# EAGLE design octanis_eps_v04 (EAGLE 7.2.0)
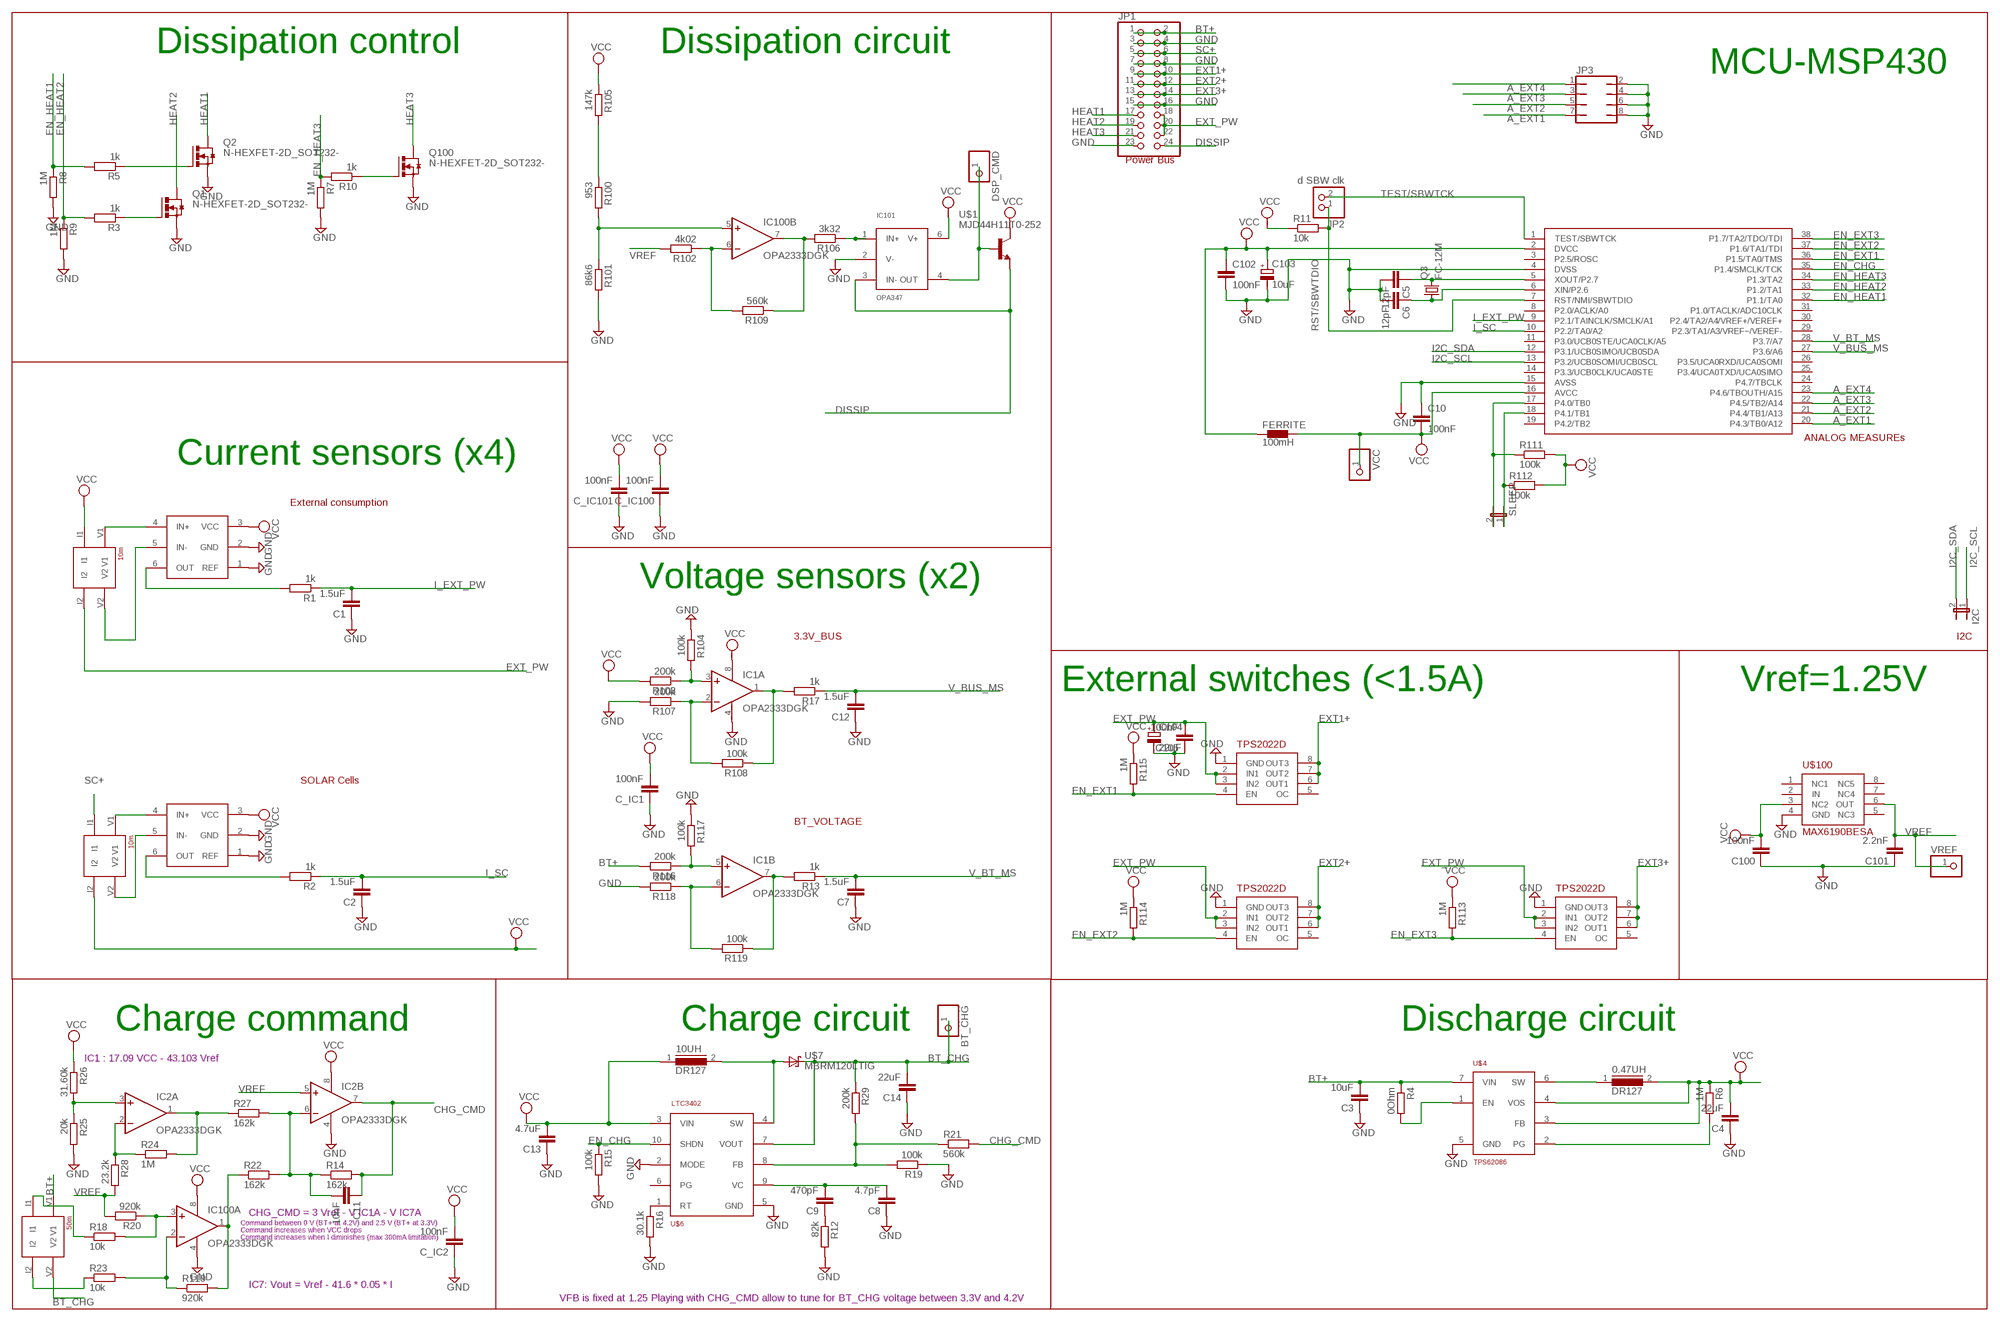
[diagram p0: schematic, sheet 1]

## Parts
0.47UH  DR127  [DR127]
10UH  DR127  [DR127]
BT_CHG  PINHD-1X1  [1X01]
C1  1.5uF  C-EUC0603  [C0603]
C2  1.5uF  C-EUC0603  [C0603]
C3  10uF  C-EUC1206  [C1206]
C4  22uF  C-EUC1206  [C1206]
C5  12pF  C-EUC0603  [C0603]
C6  12pF  C-EUC0603  [C0603]
C7  1.5uF  C-EUC0603  [C0603]
C8  4.7pF  C-EUC0603  [C0603]
C9  470pF  C-EUC0603  [C0603]
C10  100nF  C-EUC0603  [C0603]
C11  10nF  C-EUC0603  [C0603]
C12  1.5uF  C-EUC0603  [C0603]
C13  4.7uF  C-EUC1206  [C1206]
C14  22uF  C-EUC0603  [C0603]
C100  100nF  C-EUC0603  [C0603]
C101  2.2nF  C-EUC0603  [C0603]
C102  100nF  C-EUC0603  [C0603]
C103  10uF  CPOL-EUA/3216-18R  [A/3216-18R]
C104  22uF  CPOL-EUA/3216-18R  [A/3216-18R]
C105  100nF  C-EUC0603  [C0603]
C_IC1  100nF  C-EUC0603  [C0603]
C_IC2  100nF  C-EUC0603  [C0603]
C_IC100  100nF  C-EUC0603  [C0603]
C_IC101  100nF  C-EUC0603  [C0603]
DSP_CMD  PINHD-1X1  [1X01]
FERRITE  100mH  BLM15HD601SN1  [0402]
I2C  JP1E  [JP1]
IC1  OPA2333DGK  [MSOP08]
IC2  OPA2333DGK  [MSOP08]
IC100  OPA2333DGK  [MSOP08]
IC101  OPA347  [SC70-5]
JP1  PINHD-2X12  [2X12]
JP2  d SBW clk  PINHD-1X2  [1X02]
JP3  JP4Q  [JP4Q]
Q1  N-HEXFET-2D_SOT232-  [SOT223]
Q2  N-HEXFET-2D_SOT232-  [SOT223]
Q3  FC-12M  [FC-12M]
Q100  N-HEXFET-2D_SOT232-  [SOT223]
R1  1k  R-EU_R0603  [R0603]
R2  1k  R-EU_R0603  [R0603]
R3  1k  R-EU_R0603  [R0603]
R4  0Ohm  R-EU_R0603  [R0603]
R5  1k  R-EU_R0603  [R0603]
R6  1M  R-EU_R0603  [R0603]
R7  1M  R-EU_R0603  [R0603]
R8  1M  R-EU_R0603  [R0603]
R9  1M  R-EU_R0603  [R0603]
R10  1k  R-EU_R0603  [R0603]
R11  10k  R-EU_R0603  [R0603]
R12  82k  R-EU_R0603  [R0603]
R13  1k  R-EU_R0603  [R0603]
R14  162k  R-EU_R0603  [R0603]
R15  100k  R-EU_R0603  [R0603]
R16  30.1k  R-EU_R0603  [R0603]
R17  1k  R-EU_R0603  [R0603]
R18  10k  R-EU_R0603  [R0603]
R19  100k  R-EU_R0603  [R0603]
R20  920k  R-EU_R0603  [R0603]
R21  560k  R-EU_R0603  [R0603]
R22  162k  R-EU_R0603  [R0603]
R23  10k  R-EU_R0603  [R0603]
R24  1M  R-EU_R0603  [R0603]
R25  20k  R-EU_R0603  [R0603]
R26  31.60k  R-EU_R0603  [R0603]
R27  162k  R-EU_R0603  [R0603]
R28  23.2k  R-EU_R0603  [R0603]
R29  200k  R-EU_R0603  [R0603]
R100  953  R-EU_R0603  [R0603]
R101  86k6  R-EU_R0603  [R0603]
R102  4k02  R-EU_R0603  [R0603]
R103  200k  R-EU_R0603  [R0603]
R104  100k  R-EU_R0603  [R0603]
R105  147k  R-EU_R0603  [R0603]
R106  3k32  R-EU_R0603  [R0603]
R107  200k  R-EU_R0603  [R0603]
R108  100k  R-EU_R0603  [R0603]
R109  560k  R-EU_R0603  [R0603]
R110  920k  R-EU_R0603  [R0603]
R111  100k  R-EU_R0603  [R0603]
R112  100k  R-EU_R0603  [R0603]
R113  1M  R-EU_R0603  [R0603]
R114  1M  R-EU_R0603  [R0603]
R115  1M  R-EU_R0603  [R0603]
R116  200k  R-EU_R0603  [R0603]
R117  100k  R-EU_R0603  [R0603]
R118  200k  R-EU_R0603  [R0603]
R119  100k  R-EU_R0603  [R0603]
R_SENSE1  10m  CURRENT_RESISTOR  [4PADS_RESISTOR]
RSENSE1  10m  CURRENT_RESISTOR  [4PADS_RESISTOR]
RSENSE2  50m  CURRENT_RESISTOR  [4PADS_RESISTOR]
SLEEP  JP1E  [JP1]
U$1  MJD44H11T0-252  [TO252]
U$2  INA213  [SC70-6]
U$3  INA213  [SC70-6]
U$4  TPS62086  [QFN-7]
U$5  MSP430G2544  [TSSOP38_MSPGXX44_SERIES]
U$6  LTC3402  [MSOP10]
U$7  MBRM120LTIG  [DO216AA]
U$100  MAX6190BESA  [SO8]
U$101  TPS2022D  [SO8]
U$102  TPS2022D  [SO8]
U$103  TPS2022D  [SO8]
VCC  PINHD-1X1  [1X01]
VREF  PINHD-1X1  [1X01]

## Nets
A_EXT1: JP3.7 U$5.20(P4.3/TB0/A12)
A_EXT2: JP3.5 U$5.21(P4.4/TB1/A13)
A_EXT3: JP3.3 U$5.22(P4.5/TB2/A14)
A_EXT4: JP3.1 U$5.23(P4.6/TBOUTH/A15)
BT+: C3.2 JP1.1 JP1.2 R4.1 R116.2 RSENSE2.V1 U$4.7(VIN)
BT_CHG: BT_CHG.1 C14.2 R29.1 RSENSE2.V2 U$6.7(VOUT) U$7.C(K)
CHG_CMD: C11.1 IC2.7(B:OUT) R14.2 R21.2
DISSIP: IC101.3(IN-) JP1.24 U$1.3(E)
EN_CHG: R15.1 U$5.35(P1.4/SMCLK/TCK) U$6.10(SHDN)
EN_EXT1: R115.2 U$5.36(P1.5/TA0/TMS) U$103.4(EN)
EN_EXT2: R114.2 U$5.37(P1.6/TA1/TDI) U$102.4(EN)
EN_EXT3: R113.2 U$5.38(P1.7/TA2/TDO/TDI) U$101.4(EN)
EN_HEAT1: R5.2 R8.1 U$5.32(P1.1/TA0)
EN_HEAT2: R3.2 R9.1 U$5.33(P1.2/TA1)
EN_HEAT3: R7.1 R10.2 U$5.34(P1.3/TA2)
EXT1+: JP1.9 JP1.10 U$103.6(OUT1) U$103.7(OUT2) U$103.8(OUT3)
EXT2+: JP1.11 JP1.12 U$102.6(OUT1) U$102.7(OUT2) U$102.8(OUT3)
EXT3+: JP1.13 JP1.14 U$101.6(OUT1) U$101.7(OUT2) U$101.8(OUT3)
EXT_PW: C104.+ C105.2 JP1.18 JP1.20 JP1.22 R_SENSE1.I2 U$101.2(IN1) U$101.3(IN2) U$102.2(IN1) U$102.3(IN2) U$103.2(IN1) U$103.3(IN2)
GND: C1.1 C2.1 C3.1 C4.1 C5.2 C6.2 C7.1 C8.1 C10.1 C12.1 C13.1 C14.1 C100.1 C101.1 C102.2 C103.- C104.- C105.1 C_IC1.1 C_IC2.1 C_IC100.1 C_IC101.1 IC1.4(P:V-) IC2.4(P:V-) IC100.4(P:V-) IC101.2(V-) JP1.3 JP1.4 JP1.7 JP1.8 JP1.15 JP1.16 JP1.23 JP3.2 JP3.4 JP3.6 JP3.8 Q1.3(S) Q2.3(S) Q100.3(S) R7.2 R8.2 R9.2 R12.2 R15.2 R16.2 R19.1 R25.2 R101.2 R104.1 R107.2 R117.1 R118.2 U$2.1(REF) U$2.2(GND) U$3.1(REF) U$3.2(GND) U$4.5(GND) U$5.4(DVSS) U$5.15(AVSS) U$6.2(MODE) U$6.5(GND) U$100.4(GND) U$101.1(GND) U$102.1(GND) U$103.1(GND)
HEAT1: JP1.17 Q2.2(D) Q2.4(D)
HEAT2: JP1.19 Q1.2(D) Q1.4(D)
HEAT3: JP1.21 Q100.2(D) Q100.4(D)
I2C_SCL: I2C.1 U$5.13(P3.2/UCB0SOMI/UCB0SCL)
I2C_SDA: I2C.2 U$5.12(P3.1/UCB0SIMO/UCB0SDA)
I_EXT_PW: C1.2 R1.1 U$5.9(P2.1/TAINCLK/SMCLK/A1)
I_SC: C2.2 R2.1 U$5.10(P2.2/TA0/A2)
N$1: R1.2 U$3.6(OUT)
N$2: R2.2 U$2.6(OUT)
N$3: R16.1 U$6.1(RT)
N$4: C9.1 R12.1
N$5: IC100.1(A:OUT) R22.1 R110.2
N$6: IC2.3(A:+IN) R25.1 R26.2
N$7: IC2.2(A:-IN) R24.1 R28.1
N$8: C8.2 C9.2 U$6.9(VC)
N$9: IC2.1(A:OUT) R24.2 R27.1
N$10: IC1.7(B:OUT) R13.2 R119.1
N$11: C11.2 IC2.6(B:-IN) R14.1 R22.2 R27.2
N$12: IC1.1(A:OUT) R17.2 R108.1
N$13: IC1.2(A:-IN) R107.1 R108.2
N$14: IC1.3(A:+IN) R103.1 R104.2
N$15: IC1.6(B:-IN) R118.1 R119.2
N$16: IC1.5(B:+IN) R116.1 R117.2
N$17: IC100.2(A:-IN) R23.2 R110.1
N$18: R100.1 R105.2
N$19: IC100.5(B:+IN) R100.2 R101.1
N$20: IC100.6(B:-IN) R102.1 R109.2
N$21: IC100.7(B:OUT) R106.2 R109.1
N$22: IC101.1(IN+) R106.1
N$23: R19.2 R21.1 R29.2 U$6.8(FB)
N$24: 10UH.2 U$6.4(SW) U$7.A
N$25: R6.2 U$4.2(PG)
N$26: 0.47UH.1 U$4.6(SW)
N$28: IC100.3(A:+IN) R18.2 R20.1
N$29: Q2.1(G) R5.1
N$30: R4.2 U$4.1(EN)
N$31: Q1.1(G) R3.1
N$32: R_SENSE1.V1 U$3.4(IN+)
N$33: R_SENSE1.V2 U$3.5(IN-)
N$34: RSENSE1.V1 U$2.4(IN+)
N$35: RSENSE1.V2 U$2.5(IN-)
N$37: Q100.1(G) R10.1
N$38: R23.1 RSENSE2.I2
N$40: R18.1 RSENSE2.I1
N$45: DSP_CMD.1 IC101.4(OUT) U$1.1(B)
N$48: C5.1 Q3.2 U$5.5(XOUT/P2.7)
N$50: C6.1 Q3.1 U$5.6(XIN/P2.6)
RST/SBWTDIO: JP2.1 R11.2 U$5.7(RST/NMI/SBWTDIO)
SC+: JP1.5 JP1.6 RSENSE1.I1
TB0: R111.1 SLEEP.2 U$5.17(P4.0/TB0)
TB1: R112.1 SLEEP.1 U$5.18(P4.1/TB1)
TEST/SBWTCK: JP2.2 U$5.1(TEST/SBWTCK)
V_BT_MS: C7.2 R13.1 U$5.28(P3.7/A7)
V_BUS_MS: C12.2 R17.1 U$5.27(P3.6/A6)
VCC: 0.47UH.2 10UH.1 C4.2 C10.2 C13.2 C100.2 C102.1 C103.+ C_IC1.2 C_IC2.2 C_IC100.2 C_IC101.2 FERRITE.1 FERRITE.2 IC1.8(P:V+) IC2.8(P:V+) IC100.8(P:V+) IC101.6(V+) R6.1 R11.1 R26.1 R103.2 R105.1 R111.2 R112.2 R113.1 R114.1 R115.1 R_SENSE1.I1 RSENSE1.I2 U$1.2(C) U$2.3(VCC) U$3.3(VCC) U$4.3(FB) U$4.4(VOS) U$5.2(DVCC) U$5.16(AVCC) U$6.3(VIN) U$100.3(NC2) VCC.1
VREF: C101.2 IC2.5(B:+IN) R20.2 R28.2 R102.2 U$100.6(OUT) VREF.1
Unconnected: U$5.3(P2.5/ROSC) U$5.8(P2.0/ACLK/A0) U$5.11(P3.0/UCB0STE/UCA0CLK/A5) U$5.14(P3.3/UCB0CLK/UCA0STE) U$5.19(P4.2/TB2) U$5.24(P4.7/TBCLK) U$5.25(P3.4/UCA0TXD/UCA0SIMO) U$5.26(P3.5/UCA0RXD/UCA0SOMI) U$5.29(P2.3/TA1/A3/VREF−/VEREF-) U$5.30(P2.4/TA2/A4/VREF+/VEREF+) U$5.31(P1.0/TACLK/ADC10CLK) U$6.6(PG) U$100.1(NC1) U$100.2(IN) U$100.5(NC3) U$100.7(NC4) U$100.8(NC5) U$101.5(OC) U$102.5(OC) U$103.5(OC)

## Notes on the sheet
- Dissipation control | Dissipation circuit
- MCU-MSP430
- Power Bus
- ANALOG MEASUREs
- Current sensors (x4)
- External consumption
- Voltage sensors (x2)
- 3.3V_BUS | I2C
- External switches (<1.5A) | Vref=1.25V
- SOLAR Cells
- BT_VOLTAGE
- Charge command | Charge circuit | Discharge circuit
- IC1 : 17.09 VCC - 43.103 Vref
- CHG_CMD = 3 Vref - V IC1A - V IC7A
- Command between 0 V (BT+ at 4.2V) and 2.5 V (BT+ at 3.3V)
- Command increases when VCC drops
- Command increases when I diminishes (max 300mA limitation)
- IC7: Vout = Vref - 41.6 * 0.05 * I
- VFB is fixed at 1.25 Playing with CHG_CMD allow to tune for BT_CHG voltage between 3.3V and 4.2V

## Library data of the parts
0.47UH 10UH = inductors:DR127: High Power Density, High Efficiency, Shielded Inductors Source: coiltronics_dr_series.pdf
BT_CHG DSP_CMD VCC VREF = pinhead:PINHD-1X1: PIN HEADER
C1-C14 C100-C102 C105 C_IC1 C_IC2 C_IC100 C_IC101 = rcl:C-EU: CAPACITOR, European symbol
C103 C104 = rcl:CPOL-EU: POLARIZED CAPACITOR, European symbol
FERRITE = inductors:BLM15H: EMIFIL (R) Chip Ferrite Bead for GHz Noise Source: http://www.murata.com/ Ferrite Bead BLM15H.pdf
I2C SLEEP = jumper:JP1E: JUMPER
IC1 IC2 IC100 = linear:OPA2333: DUAL 1.8V, microPOWER CMOS OPERATIONAL AMPLIFIERS Zerø-Drift Series Source: Texas Instruments (Burr-Brown) .. U11 opa333 Operational Amp.pdf
IC101 = Octanis1_EPS:OPA347: micro Power, Rail-to-Rail Operational Amplifiers
JP1 = pinhead:PINHD-2X12: PIN HEADER
JP2 = pinhead:PINHD-1X2: PIN HEADER
JP3 = jumper:JP4Q: JUMPER
Q1 Q2 Q100 = transistor-power:N-HEXFET-2D_?-*: HEXFET® Power MOSFET 2 Drain connects http://www.irf.com/product-info/datasheets/data/irll014n.pdf
Q3 = crystal:FC-12M: kHz RANGE CRYSTAL UNIT LOW PROFILE SMD Source: Epson Toyocom FC-12M.pdf
R1-R29 R100-R119 = rcl:R-EU_: RESISTOR, European symbol
R_SENSE1 RSENSE1 RSENSE2 = Octanis1_EPS:CURRENT_RESISTOR
U$1 = Octanis1_EPS:MJD44H11: MJD44H11, MJD45H11 Complementary power transistors
U$2 U$3 = Octanis1_EPS:INA213: Voltage Output, High or Low Side Measurement, Bi-Directional Zer ø -Drift Series Current-Shunt Monitor
U$4 = Octanis1_EPS:TPS62086: 3-A Step-Down Converter with Hiccup Short Circuit Protection in 2x2 QFN Package Fixed 3.3V operation
U$5 = Octanis1_EPS:MSP430G2544: MSP430G2x44 Mixed-Signal Microcontrollers
U$6 = Octanis1_EPS:LTC3402: 1 LTC3402 3402fb 2A, 3MHz Micropower Synchronous Boost Converter
U$7 = Octanis1_EPS:MBRM120LTIG
U$100 = Octanis1_EPS:MAX6190BESA: MAX6190–MAX6195/MAX6198 Precision, Micropower, Low-Dropout Voltage References
U$101-U$103 = Octanis1_EPS:TPS2022D: TEXAS INSTRUMENTS - TPS2022D - IC, 1.5A PWR DIST SWITCH 8SOIC

## Net classes
0 default: clearance 0.205 mm

## Board
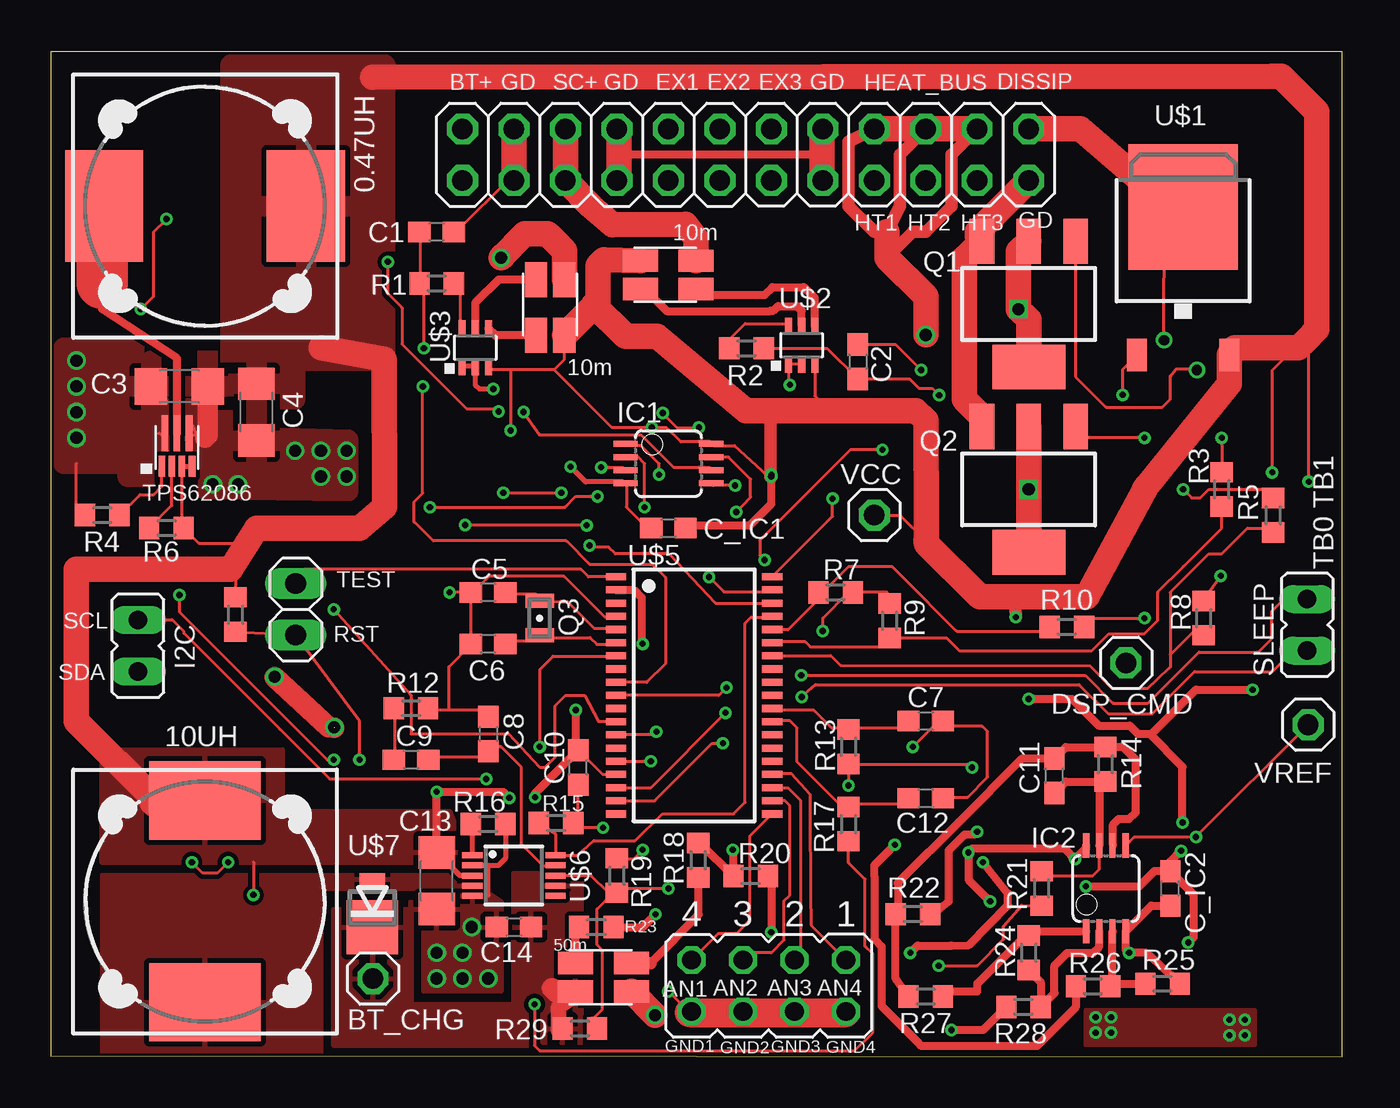
[diagram p1: board, top side]
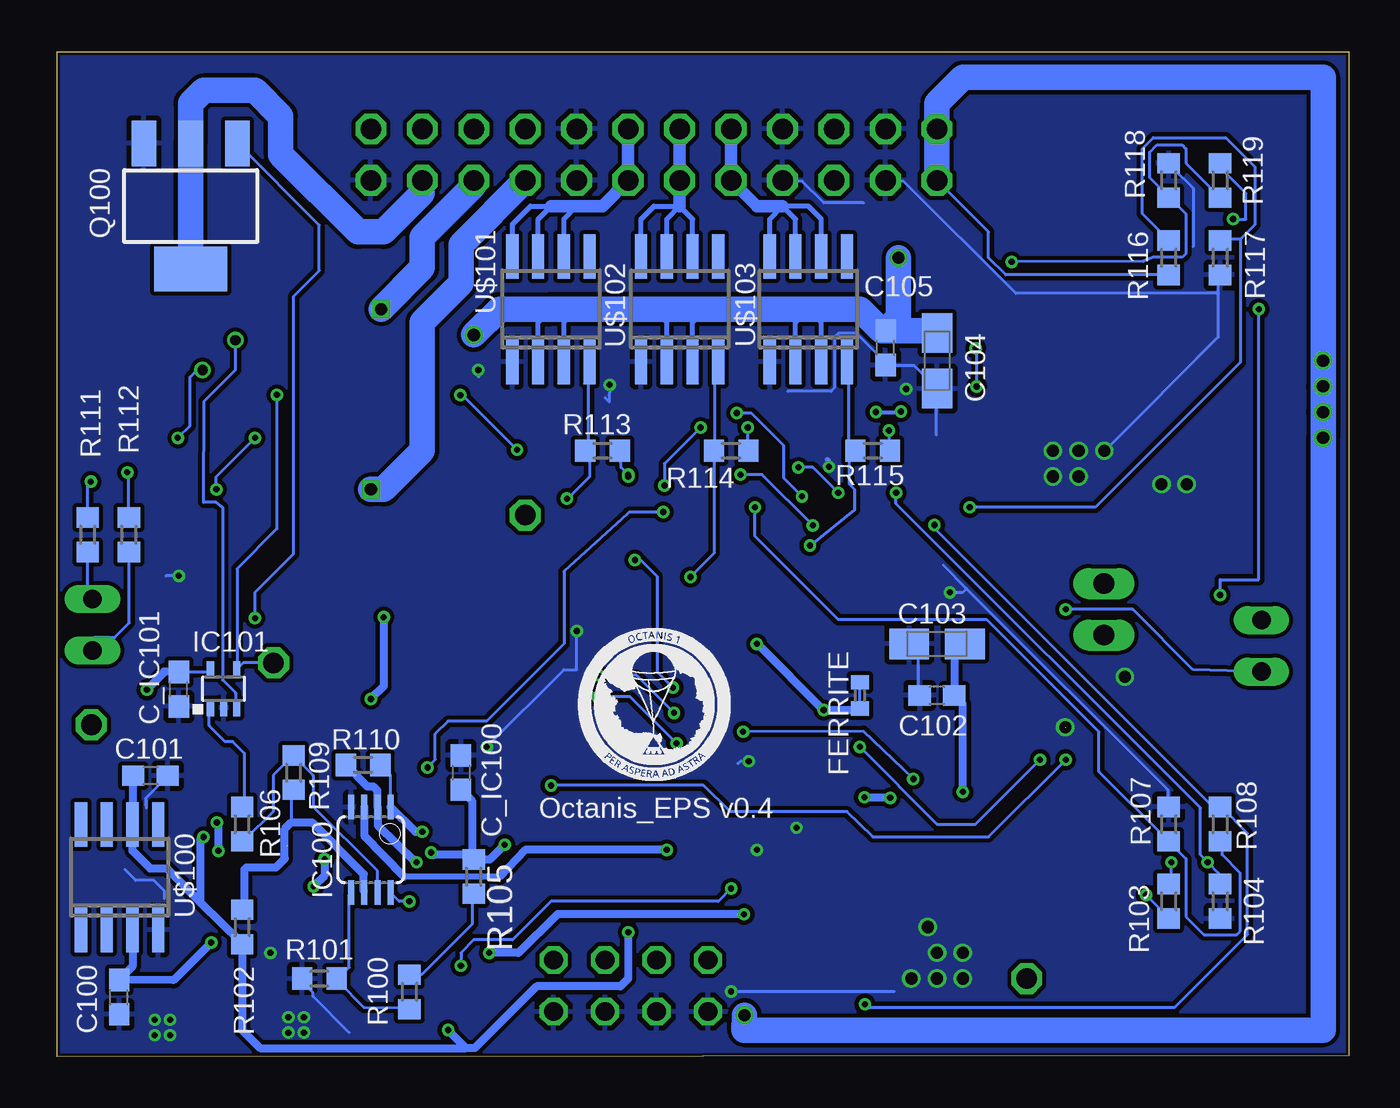
[diagram p2: board, bottom side, seen from below]

Size 63.73 x 49.57 mm. Coordinates in mm from the lower left corner, seen from the top.
Outline: 0,0.05 63.73,0 63.73,49.57 0,49.57 0,0.05
Copper layers (1*2*15*16): Top 0.035mm / dielectric 0.2mm / layer 2 0.0175mm / dielectric 1.1mm / layer 15 0.0175mm / dielectric 0.2mm / Bottom 0.035mm
Design rules "SeeedStudio_DRU_no_angle_20130527 *": minimum track width 6mil, minimum drill 12mil, track to track 6mil, track to pad 6mil, pad to pad 6mil, via to via 6mil, smd to smd 0mil, copper to edge 6mil, drill to drill 6mil, minimum pad ring 6mil, minimum via ring 6mil, stop-mask expansion 2mil, vias tented up to drill 25mil, thermal gap 10mil

### Footprints (pad centres in the part's own frame; a part is rotated, then mirrored left to right if it is on the bottom)
DR127 = smd 3.85 x 5.5: 1 -4.975,0; 2 4.975,0
1X01 = drill 1.016 octagon: 1 0,0
C0603 = smd 1.1 x 1: 1 -0.85,0; 2 0.85,0
C1206 = smd 1.6 x 1.8: 1 -1.4,0; 2 1.4,0
A/3216-18R = smd 1.95 x 1.5: + 1.375,0; - -1.375,0
0402 = smd 0.7 x 0.9: 1 -0.65,0; 2 0.65,0
JP1 = drill 0.914 long: 1 0,-1.27; 2 0,1.27
MSOP08 = smd 0.3 x 1.2: 1 -0.976,-2.113; 2 -0.326,-2.113; 3 0.324,-2.113; 4 0.974,-2.113; 5 0.974,2.112; 6 0.324,2.112; 7 -0.326,2.112; 8 -0.976,2.112
SC70-5 = smd 0.35 x 0.8: 1 -0.65,-0.95; 2 0,-0.95; 3 0.65,-0.95; 4 0.65,0.95; 6 -0.65,0.95
2X12 = drill 1.016 octagon: 1 -13.97,-1.27; 2 -13.97,1.27; 3 -11.43,-1.27; 4 -11.43,1.27; 5 -8.89,-1.27; 6 -8.89,1.27; 7 -6.35,-1.27; 8 -6.35,1.27; 9 -3.81,-1.27; 10 -3.81,1.27; 11 -1.27,-1.27; 12 -1.27,1.27; 13 1.27,-1.27; 14 1.27,1.27; 15 3.81,-1.27; 16 3.81,1.27; 17 6.35,-1.27; 18 6.35,1.27; 19 8.89,-1.27; 20 8.89,1.27; 21 11.43,-1.27; 22 11.43,1.27; 23 13.97,-1.27; 24 13.97,1.27
1X02 = drill 1.016 long: 1 -1.27,0; 2 1.27,0
JP4Q = drill 0.914 octagon: 1 -3.81,-1.27; 2 -3.81,1.27; 3 -1.27,-1.27; 4 -1.27,1.27; 5 1.27,-1.27; 6 1.27,1.27; 7 3.81,-1.27; 8 3.81,1.27
SOT223 = smd 1.219 x 2.235: 1 -2.311,-3.099; 2 0,-3.099; 3 2.311,-3.099 | smd 3.6 x 2.2: 4 0,3.099
FC-12M = smd 0.7 x 1.4: 1 -0.85,0; 2 0.85,0
R0603 = smd 1 x 1.1: 1 -0.85,0; 2 0.85,0
4PADS_RESISTOR = smd 1.727 x 1.1: I1 0,0; I2 2.751,0; V1 0,1.4; V2 2.751,1.4
TO252 = smd 1 x 1.6: 1 -2.28,-4.8; 2 2.28,-4.8 | smd 5.4 x 6.2: 3 0,2.5
SC70-6 = smd 0.35 x 0.8: 1 -0.65,-0.95; 2 0,-0.95; 3 0.65,-0.95; 4 0.65,0.95; 5 0,0.95; 6 -0.65,0.95
QFN-7 = smd 0.33 x 1.016: 1 1.501,0.127; 2 1.001,0.127; 3 0.5,0.127; 4 0,0.127 | smd 0.33 x 1.778: 5 0.15,-1.499; 6 0.749,-1.499; 7 1.349,-1.499
TSSOP38_MSPGXX44_SERIES = smd 0.35 x 1: 1 -5.85,-3.85; 2 -5.2,-3.85; 3 -4.55,-3.85; 4 -3.9,-3.85; 5 -3.25,-3.85; 6 -2.6,-3.85; 7 -1.95,-3.85; 8 -1.3,-3.85; 9 -0.65,-3.85; 10 0,-3.85; 11 0.65,-3.85; 12 1.3,-3.85; 13 1.95,-3.85; 14 2.6,-3.85; 15 3.25,-3.85; 16 3.9,-3.85; 17 4.55,-3.85; 18 5.2,-3.85; 19 5.85,-3.85; 20 5.85,3.85; 21 5.2,3.85; 22 4.55,3.85; 23 3.9,3.85; 24 3.25,3.85; 25 2.6,3.85; 26 1.95,3.85; 27 1.3,3.85; 28 0.65,3.85; 29 0,3.85; 30 -0.65,3.85; 31 -1.3,3.85; 32 -1.95,3.85; 33 -2.6,3.85; 34 -3.25,3.85; 35 -3.9,3.85; 36 -4.55,3.85; 37 -5.2,3.85; 38 -5.85,3.85
MSOP10 = smd 0.3 x 1: 1 -1,-2.05; 2 -0.5,-2.05; 3 0,-2.05; 4 0.5,-2.05; 5 1,-2.05; 6 1,2.05; 7 0.5,2.05; 8 0,2.05; 9 -0.5,2.05; 10 -1,2.05
DO216AA = smd 0.635 x 1.27: A 2.349,0 | smd 2.667 x 2.54: C -0.01,0
SO8 = smd 0.6 x 2.2: 1 -1.905,-2.6; 2 -0.635,-2.6; 3 0.635,-2.6; 4 1.905,-2.6; 5 1.905,2.6; 6 0.635,2.6; 7 -0.635,2.6; 8 -1.905,2.6

### Placement (x,y rotation side)
0.47UH  7.62,41.96 0 top
10UH  7.62,7.67 270 top
BT_CHG  15.9,3.86 0 top
C1  19.05,40.69 180 top
C2  39.83,34.29 270 top
C3  6.35,33.07 180 top
C4  10.16,31.8 90 top
C5  21.59,22.91 180 top
C6  21.59,20.37 180 top
C7  43.18,16.56 180 top
C8  21.59,15.93 270 top
C9  17.78,14.66 0 top
C10  26.04,14.27 90 top
C11  49.53,13.87 90 top
C12  43.18,12.75 180 top
C13  19.05,8.69 90 top
C14  22.86,6.4 0 top
C100  60.68,2.95 90 bottom
C101  59.13,13.87 180 bottom
C102  20.32,17.83 180 bottom
C103  20.32,20.37 0 bottom
C104  20.32,34.34 90 bottom
C105  22.86,34.98 90 bottom
C_IC1  30.48,26.09 0 top
C_IC2  55.24,8.31 90 top
C_IC100  43.81,14.02 270 bottom
C_IC101  57.73,18.14 90 bottom
DSP_CMD  53.06,19.43 0 top
FERRITE  24.13,17.83 270 bottom
I2C  4.32,20.27 180 top
IC1  30.48,29.26 270 top
IC2  52.07,8.31 0 top
IC100  48.26,10.21 180 bottom
IC101  55.52,18.16 0 bottom
JP1  34.29,44.5 0 top
JP2  12.09,22.07 90 top
JP3  35.43,3.51 180 top
Q1  48.26,37.13 180 top
Q2  48.26,27.99 180 top
Q3  24.13,21.64 90 top
Q100  57.15,41.96 180 bottom
R1  19.05,38.15 0 top
R2  34.34,34.95 180 top
R3  57.78,27.99 270 top
R4  2.54,26.72 0 top
R5  60.33,26.72 270 top
R6  5.71,26.09 180 top
R7  38.73,22.91 0 top
R8  56.9,21.64 90 top
R9  41.4,21.51 90 top
R10  50.14,21.21 180 top
R11  9.12,21.82 270 top
R12  17.78,17.2 0 top
R13  39.37,15.29 270 top
R14  52.04,14.43 270 top
R15  24.94,11.53 0 top
R16  21.59,11.48 0 top
R17  39.37,11.48 270 top
R18  31.95,9.7 90 top
R19  27.94,8.94 270 top
R20  34.54,8.92 0 top
R21  48.9,8.31 90 top
R22  42.55,7.04 180 top
R23  26.92,6.4 0 top
R24  48.26,5.13 90 top
R25  54.86,3.61 0 top
R26  51.44,3.48 0 top
R27  43.18,2.97 180 top
R28  48.01,2.46 180 top
R29  26.11,1.4 0 top
R100  46.35,3.2 270 bottom
R101  50.8,3.86 180 bottom
R102  54.61,6.4 270 bottom
R103  8.89,7.67 270 bottom
R104  6.35,7.67 90 bottom
R105  43.18,8.89 270 bottom
R106  54.61,11.48 270 bottom
R107  8.89,11.48 90 bottom
R108  6.35,11.48 270 bottom
R109  52.07,14.02 270 bottom
R110  48.64,14.4 0 bottom
R111  62.23,25.76 90 bottom
R112  60.2,25.76 90 bottom
R113  36.83,29.9 180 bottom
R114  30.48,29.9 180 bottom
R115  23.5,29.9 180 bottom
R116  8.89,39.42 270 bottom
R117  6.35,39.42 90 bottom
R118  8.89,43.23 90 bottom
R119  6.35,43.23 270 bottom
R_SENSE1  25.35,35.59 90 top
RSENSE1  31.85,39.27 180 top
RSENSE2  28.65,4.62 180 top
SLEEP  62,21.31 0 top
U$1  55.88,39.42 0 top
U$2  37.06,35.1 0 top
U$3  20.95,34.98 0 top
U$4  6.99,29.26 180 top
U$5  31.75,17.83 270 top
U$6  22.86,8.94 270 top
U$7  15.88,6.4 90 top
U$100  60.66,8.86 0 bottom
U$101  39.37,36.88 0 bottom
U$102  33.02,36.88 0 bottom
U$103  26.67,36.88 0 bottom
VCC  40.64,26.72 0 top
VREF  62.05,16.38 0 top

### Tracks (layer width: path | path; a pad name or v marks a point on that pad's centre or on a via)
A_EXT1
  Top 0.152: U$5.20 34.49,10.87 34.49,6.73 33.83,6.07 32.92,6.07 JP3.7
A_EXT2
  Top 0.152: U$5.21 36.25,12.62 36.47,12.39 36.47,7.98 36.2,7.7 36.2,5.77 35.56,5.13 34.52,5.13 JP3.5
A_EXT3
  Top 0.152: U$5.22 35.62,13.26 36.4,13.26 37.01,12.65 37.01,5.08 JP3.3
A_EXT4
  Top 0.152: U$5.23 35.64,13.97 36.55,13.97 37.49,12.93 37.53,7.3 37.53,6.49 JP3.1
BT+  (via drill 0.6)
  Top 0.152: 5.72,30.69 U$4.7 5.71,30.53 5.32,30.76 | R4.1 1.27,27.14 1.27,29.26
  Top 1.27: v29.82,2.06 RSENSE2.V1
  Bottom 0.152: R116.2 16.93,38.57 17.78,39.42 17.78,40.69 JP1.1
  Bottom 1.016: JP1.1 JP1.2
  Bottom 1.27: JP1.1 20.32,47.04 19.05,48.31 1.27,48.31 v1.27,33.07 v1.27,31.8 v1.27,30.53 1.27,1.32 29.84,1.32 v29.82,2.06
  other vias: 1.27,34.34
  pour Top: 0.64,29.26 3.81,29.26 3.81,28.63 5.71,28.63 5.71,33.71 4.45,34.98 0.64,34.98
BT_CHG
  Top 0.762: 25.07,1.3 25.07,2.44 25.91,3.02
  Top 1.016: 25.86,3.15 24.97,3.15 24.74,3.38
  pour Top: 13.97,7.29 17.78,7.29 17.78,2.59 22.86,2.59 22.86,9.07 26.16,9.07 26.16,0.56 13.97,0.56
CHG_CMD
  Top 0.152: 51.82,10.49 IC2.7 51.74,9.25 51.44,8.94 49.11,8.94 R21.2
  Top 0.406: C11.1 50.09,13.58 51.82,13.58 | 51.82,13.58 R14.2 | 51.82,13.58 51.74,13.5 IC2.7
DISSIP  (via drill 0.5)
  Top 0.152: 56.52,40.06 U$1.3 | v54.94,35.36 54.97,41.48 54.55,41.82 54.55,42.55
  Top 1.27: U$1.3 55.28,41.92 54.55,42.55 50.8,45.77 JP1.24
  Bottom 0.152: v54.94,35.36 54.94,33.88 56.49,32.33 56.52,27.36 55.88,27.36 55.58,27.11 55.58,18.59 54.94,17.96 54.94,17.28 IC101.3
EN_CHG
  Top 0.152: U$5.35 35.56,21.69 34.57,21.69 34.27,21.39 34.27,12.55 33.71,11.99 30.2,11.99 28.83,10.67 26.8,10.67 25.99,9.94 U$6.10 24.91,10.99 R15.1
EN_EXT1  (via drill 0.3)
  Top 0.152: U$5.36 32.82,22.38 30.5,24.82 27.86,24.82 27.53,25.15 26.67,25.15 v26.59,25.22
  Bottom 0.152: 24.66,30.15 24.66,34.26 U$103.4 | 24.66,30.15 24.48,29.97 R115.2 | 24.66,30.15 24.66,28.27 24.38,27.99 24.38,26.97 v26.59,25.22
EN_EXT2  (via drill 0.3)
  Top 0.152: v32.49,23.67 33.22,22.94 35.51,22.94 U$5.37
  Bottom 0.152: U$102.4 31.27,34.26 31.27,29.97 R114.2 31.33,24.83 v32.49,23.67
EN_EXT3  (via drill 0.3 pad 0.25)
  Top 0.152: U$5.38 35.92,24 38.58,26.66 v38.58,27.53 38.61,27.51
  Bottom 0.152: U$101.4 37.53,34.26 37.53,29.97 R113.2 37.47,29.9 37.47,28.63 38.56,27.53 v38.58,27.53
EN_HEAT1
  Top 0.152: R5.2 60.11,26.09 59.05,26.09 57.78,24.82 57.15,24.82 55.24,22.91 55.24,19.84 | R8.1 56.52,21.01 56.41,21.01 55.24,19.84 | U$5.32 38.5,19.79 38.96,19.32 51.28,19.28 52.4,18.16 54.13,18.16 55.21,19.19 arc90 55.24,19.23 55.24,19.84
EN_HEAT2
  Top 0.152: 57.37,26.72 R3.2 57.78,26.09 55.88,24.18 54.61,22.91 54.63,22.89 54.61,22.86 54.61,21.51 53.95,20.85 52.2,20.85 51.38,20.04 44.83,20.04 44.21,20.66 R9.1 40.96,20.22 37.49,20.22 37.24,20.47 35.64,20.47 U$5.33
EN_HEAT3
  Top 0.152: U$5.34 35.62,21.06 36.37,21.06 37.88,22.57 R7.1 38.1,22.91 39.37,24.18 41.53,24.18 41.66,24.05 42.04,23.67 44.7,21.01 49.16,21.01 R10.2
EXT1+
  Bottom 0.254: U$103.7 27.3,41.33 27.94,41.96 | U$103.8 28.57,41.33 27.94,41.96 | U$103.6 26.04,41.33 26.67,41.96 27.94,41.96
  Bottom 0.61: JP1.10 JP1.9 29.21,41.96 27.94,41.96
EXT2+
  Bottom 0.254: U$102.6 32.38,41.33 33.02,41.96 | U$102.7 33.66,41.33 33.02,41.96 | U$102.8 34.92,41.33 34.29,41.96 33.02,41.96
  Bottom 0.61: JP1.12 JP1.11 33.02,41.96
EXT3+
  Bottom 0.254: U$101.6 38.73,41.33 38.1,41.96 | U$101.7 40.01,41.33 39.37,41.96 40.39,41.96 41.27,41.07 U$101.8
  Bottom 0.61: JP1.14 JP1.13 36.83,41.96 38.1,41.96 39.37,41.96
EXT_PW  (via drill 0.6)
  Top 0.152: 21.98,38.91 v22.23,39.42
  Top 0.61: JP1.22 44.45,44.5 44.45,41.96 43.18,40.69 42.55,40.69 41.27,39.42 | JP1.20 41.91,44.5 41.91,41.96 41.27,40.69 40.64,40.69 39.37,41.96 39.37,45.14 JP1.18
  Top 1.27: 22.38,39.57 v22.23,39.42 23.39,40.59 24.51,40.59 25.35,39.75 R_SENSE1.I2 | JP1.18 JP1.20 JP1.22 | 41.27,40.69 41.27,39.42 43.18,37.52 v43.18,35.61
  Bottom 0.254: U$103.3 26.04,36.25 26.67,36.88 27.3,36.25 U$103.2 | U$102.3 32.38,36.25 31.75,36.88 | U$102.2 33.66,36.25 34.29,36.88 | U$101.3 38.73,36.25 38.1,36.88 | U$101.2 40.01,36.25 39.37,36.88
  Bottom 1.27: C105.2 20.43,35.83 C104.+ | C105.2 23.07,35.83 24.13,36.88 26.67,36.88 31.75,36.88 34.29,36.88 38.1,36.88 39.37,36.88 41.91,36.88 v43.18,35.61 | v22.23,39.42 22.23,36.46 C105.2
GND  (via drill 0.3, 0.3 pad 0.25, 0.6)  (1 unrouted)
  Top 0.152: 28.06,43.37 JP1.7 | 28.06,45.7 JP1.8 | 22.87,45.7 JP1.4 | 22.87,43.37 JP1.3 22.7,43.37 20.01,40.69 C1.1 19.84,40.69 | C5.2 20.73,22.82 20.73,20.5 C6.2 20.73,20.32 19.66,19.25 19.66,17.1 | 19.66,17.1 21.27,17.1 21.44,16.93 C8.1 | 19.66,17.1 18.76,17.1 R12.2 | 20.37,34.08 U$3.1 20.19,34.08 | 20.91,34.08 U$3.2 | 28.23,28.36 IC1.4 28.41,28.18 28.41,27.11 29.31,26.22 29.48,26.22 C_IC1.1 29.66,26.04 29.84,25.86 | C5.2 20.91,23 21.62,23.72 25.33,23.72 27.33,21.72 27.89,21.72 U$5.4 | 7.15,30.66 6.97,30.69 U$4.5 6.99,31.17 7.15,30.76 | 7.86,30.15 7.62,30.53 | C12.1 44.14,12.82 45.25,12.82 46.23,13.79 46.23,16.05 45.97,16.31 44.28,16.31 C7.1 43.81,16.56 v42.55,15.29 | 21.62,7.94 21.62,9.44 | R19.1 27.88,9.78 28.78,9.78 v29.21,10.21 | C_IC2.1 55.24,7.67 | IC2.4 53.09,6.15 | C5.2 v19.68,22.91 | R9.2 41.27,22.28 41.27,22.91 R7.2 39.37,22.91 38.1,21.64 v38.1,21.01 | R8.2 57.15,22.91 v57.73,23.72 | U$5.15 v29.62,14.58 | U$2.2 U$2.1 36.41,33.21 v36.47,33.15 | C2.1 41.7,35.14 v42.95,33.88 | v27.25,11.3 26.3,11.3 R15.2 26.04,11.77 C10.1 26.12,13.08 | 31.52,2.18 v30.48,3.23
  Top 0.254: R16.2 22.44,9.79 22.09,9.44 21.62,9.44 U$6.2 | 20.37,34.08 20.9,34.08 U$3.2 20.95,33.15 21.16,32.94 v21.84,32.94 | 28.23,28.36 26.4,28.36 v25.65,29.11
  Top 0.406: 28.06,44.53 38.06,44.53 | C_IC2.1 54.31,7.46 IC2.4 53.04,5.3 v53.21,5.13 54.06,5.13 R25.2
  Top 0.61: 38.06,44.5 38.06,44.25
  Top 1.016: C3.1 7.75,30.66 7.62,30.53 | 11.05,18.72 13.72,16.26 13.99,16.23
  Top 1.27: 38.06,45.7 38.06,44.53 38.06,44.25 38.06,43.37 | 28.06,45.7 28.06,44.53 28.06,43.37 | 22.87,43.37 22.87,45.7 | Q2.3 45.95,31.57 45.09,32.44 45.09,39.42 45.14,39.42 Q1.3 45.72,40.46 45.72,40.69 JP1.23
  Top 1.422: 31.52,2.18 39.24,2.18
  Bottom 0.152: 23.95,42.12 25.91,42.12 26.98,43.19 27.88,43.19 JP1.7 | 22.87,43.19 JP1.3 22.7,43.19 21.98,43.19 16.44,37.66 6.43,37.66 | 7.68,39.98 7.68,42.84 8.76,43.91 R118.2 | 6.43,38.73 R117.1 6.43,38.55 6.43,37.66 | 20.37,30.69 20.37,32.83 C104.- 20.37,33.01 21.44,34.08 22.7,34.08 C105.1 22.87,34.26 24.3,35.69 25.2,35.69 25.38,35.51 25.38,33.01 25.55,32.83 27.7,32.83 | 14.65,29.97 v14.61,29.9 | 28.41,33.55 28.41,34.26 U$103.1 | 20.01,24.25 18.86,23.1 | 18.86,23.1 8.94,13.17 8.94,12.46 R107.2 | 6.43,37.66 6.43,35.51 11.97,29.97 v12.06,29.9 | 59.33,12.28 59.33,12.43 | 59.33,12.43 59.33,12.64 | 60.4,9.24 59.86,8.71 58.97,8.71 58.44,8.17 58.44,7.81 | 41.1,33.55 41.1,34.26 U$101.1 | 21.8,20.5 C103.- 21.62,20.32 21.27,19.96 21.27,18 C102.2 21.09,17.82 | 20.73,6.56 v20.78,6.4 | 49.32,1.2 51.11,2.99 51.11,3.17 51.64,3.7 R101.2 | 21.62,3.7 v21.59,3.86 | 43.81,15.29 C_IC100.1 | v19.68,22.91 19.05,22.91 18.86,23.1 | v38.1,21.01 38.1,19.1 38.73,19.1 v42.55,15.29 | v29.62,14.58 30.02,14.58 30.12,14.48 30.15,14.48 | v42.95,33.88 42.95,33.55 42.93,33.53 | v36.47,33.15 36.5,32.31 36.7,32.51 | v57.73,23.72 58.37,23.72 | 59.33,12.43 59.37,12.43 59.37,12.75 58.42,13.7 C101.1 | v30.48,3.23 22.44,3.23
  Bottom 0.254: v21.84,32.94 22.02,32.94 22.05,32.92 | v25.65,29.11 25.65,29.39 25.73,29.46
  other vias: 13.34,29.9 9.25,28.24 13.34,28.63 19.05,5.13 19.05,3.86 20.32,3.86 20.32,5.13 51.56,1.96 51.56,1.19 52.32,1.96 52.32,1.19 58.17,1.83 58.17,1.07 58.93,1.83 58.93,1.07 14.61,28.63 8,28.24 11.05,18.75 14,16.26
  pour Top: 6.35,34.34 7.62,27.99 14.68,27.89 14.68,30.43 11.43,30.53 11.43,34.34
  pour Top: 22.23,7.67 22.23,3.23 18.41,3.23 18.41,6.4 17.78,7.04 17.78,7.67 20.32,7.67 20.32,8.94
  pour Bottom: -1.27,49.58 64.72,49.86 64.67,-0.13 -1.27,-1.22
  pour Top: 51.56,2.34 59.44,2.34 59.44,2.08 59.44,0.56 51.05,0.56 51.05,1.32 51.05,2.34
HEAT1  (via drill 0.6)
  Top 1.27: Q2.2 v48.26,27.99 Q2.4
  Bottom 1.27: JP1.17 43.81,40.06 43.81,38.15 45.72,36.25 45.72,29.9 47.62,27.99 v48.26,27.99
HEAT2  (via drill 0.6)
  Top 1.27: Q1.2 47.75,39.73 v47.75,36.88 48.26,36.37 Q1.4
  Bottom 1.27: JP1.19 43.18,42.98 45.72,40.44 45.72,38.91 v47.75,36.88
HEAT3
  Bottom 1.27: JP1.21 45.72,42.6 47.62,40.69 48.9,40.69 52.7,44.5 52.7,46.41 53.98,47.68 56.52,47.68 57.15,47.04 Q100.2 Q100.4
I2C_SCL  (via drill 0.3)
  Top 0.152: v21.49,13.71 13.76,13.71 11.31,16.15 6.58,20.89 6.58,20.98 5.99,21.57 4.29,21.57 I2C.1 | v29.89,16.03 29.73,15.88 U$5.13
  Bottom 0.152: v21.49,13.71 23.94,16.06 v29.89,16.03
I2C_SDA  (via drill 0.3)
  Top 0.152: v13.97,22.07 17.78,17.83 17.78,15.93 22.61,15.93 24.13,14.27 24.38,14.27 24.89,14.78 24.89,17.32 25.4,17.83 26.34,17.83 27.03,16.54 27.21,16.53 U$5.12
  Bottom 0.152: I2C.2 7.7,19.1 10.67,22.07 v13.97,22.07
I_EXT_PW  (via drill 0.3)
  Top 0.152: C1.2 18.23,40.51 18.23,38.19 R1.1 18.41,37.94 v18.41,34.95 | U$5.9 27.91,18.47 29.41,18.47 30.33,19.38 30.33,23.65 29.67,24.31 26.59,24.31 25.45,25.45 18.87,25.45 17.93,26.39 17.93,27.38 18.36,27.81 v18.36,33.07
  Bottom 0.152: v18.36,33.07 18.36,34.9 v18.41,34.95
I_SC  (via drill 0.3, 0.3 pad 0.25)
  Top 0.152: v33.35,18.21 32.97,17.83 U$5.10 | R2.1 38.32,34.95 C2.2 42.38,33.44 42.85,32.97 43.51,32.97 v43.84,32.64 | v41.05,29.95 39.47,29.95 35,25.48 35,24.74 v35.23,24.51
  Bottom 0.152: v35.23,24.51 34.95,24.51 34.14,23.7 34.14,19 v33.35,18.21 | v43.84,32.64 43.74,32.64 v41.05,29.95
N$1
  Top 0.152: U$3.6 20.19,36.05 20.19,37.83 20.01,38.01 R1.2
N$2
  Top 0.152: R2.2 33.49,35.4 34.27,36.17 36.29,36.17 U$2.6
N$3
  Top 0.254: U$6.1 20.81,11.41 R16.1
N$4
  Top 0.152: C9.1 16.98,14.78 16.98,17.1 R12.1
N$5  (via drill 0.3)
  Top 0.152: 43.56,7.04 R22.1
  Top 0.406: 43.56,7.04 44.32,7.67 44.32,8.23 44.32,9.88 44.32,10.19 45.11,10.97 45.59,10.97 v45.72,11.1
  Bottom 0.152: R110.2 47.28,13.89 IC100.1 47.24,12.28
  Bottom 0.406: v45.72,11.1 46.06,11.1 IC100.1
N$6
  Top 0.152: R26.2 52.67,3.61
  Top 0.406: 52.67,3.61 R25.1 | R26.2 52.39,3.59 IC2.3
N$7
  Top 0.406: IC2.2 51.74,5.44 51.44,5.13 50.16,5.13 49.53,4.5 49.53,3.14 R28.1 48.86,3.68 R24.1
N$8
  Top 0.152: U$6.9 24.84,9.42 24.3,9.42 23.23,10.49 23.23,14.28 22.23,15.29 21.8,15.29 C8.2 | 21.62,14.96 C8.2 | C9.2 18.76,14.78 21.27,14.78 21.44,14.96 C8.2
N$9
  Top 0.152: 48.47,6.19 R24.2 48.26,5.77 | R27.1 44.28,3.23
  Top 0.406: 48.47,6.19 IC2.1 | 44.28,3.23 45.72,3.23 45.72,3.61 48.09,5.98 R24.2
N$10  (via drill 0.3)
  Top 0.152: v5.71,41.33 5.08,40.69 5.08,37.52 v4.45,36.88 | v39.37,13.39 R13.2 45.3,14.44 v45.47,14.27 | v33.83,26.87 34.54,27.61 34.54,28.5 33.46,29.59 IC1.7 | v6.35,22.78 6.35,21.95 7.21,21.08 13.64,14.66 v13.97,14.66
  Bottom 0.152: v5.71,41.33 5.08,41.33 5.08,42.6 6.35,43.87 R119.1 | v4.45,36.88 4.45,23.55 6.35,23.55 v6.35,22.78 | v13.97,14.66 17.78,10.85 23.5,10.85 24.77,12.09 30.5,12.09 31.85,13.39 v39.37,13.39 | v45.47,14.27 45.09,14.66 45.09,15.93 44.45,16.56 42.55,16.56 38.73,20.37 38.73,23.95 35.61,26.77 35.51,26.87 v33.83,26.87
N$11  (1 unrouted)
  Top 0.406: R27.2 41.7,3.86 R22.2 41.81,7.15 41.81,8.58 41.95,8.73 44.81,11.58 47.94,14.72 C11.2 | 49.49,14.68 C11.2 | C11.2 50.09,15.28 R14.1 52.92,15.28 53.54,14.66 53.54,12.06 53.21,11.73 52.7,11.73 52.43,11.46 52.43,10.45
N$12  (via drill 0.3)
  Top 0.152: 39.49,10.49 R17.2 39.37,9.58 40.18,8.76 40.18,5.44 40.21,5.44 40.56,5.08 40.56,1.19 39.67,0.3 24.13,0.3 23.88,0.56 v23.88,2.59 | v30.02,28.72 30.02,29.26 29.13,30.15 28.41,30.15 IC1.1 | v20.45,26.24 26.43,26.24 v26.45,26.22
  Bottom 0.152: v30.02,28.72 28.95,28.72 v26.45,26.22 | v23.88,2.59 23.76,2.45 8.58,2.45 5,6.03 5,11.03 6.25,12.28 R108.1 6.76,12.38 20.52,26.14 20.52,26.16 v20.45,26.24
N$13  (via drill 0.3)
  Top 0.152: v29.31,27.11 29.31,29.26 28.95,29.61 28.41,29.61 IC1.2
  Bottom 0.152: R108.2 6.25,10.49 6.25,9.96 5.36,9.06 5.36,6.2 5.54,6.03 7.15,6.03 8.04,6.92 8.04,9.78 8.76,10.49 R107.1 8.94,10.67 12.33,14.07 12.33,16.03 17.87,21.57 25.2,21.57 29.31,25.68 v29.31,27.11
N$14  (via drill 0.3)
  Top 0.152: v6.97,9.6 7.5,9.06 8.22,9.06 v8.76,9.6 | v27.16,29.08 28.23,29.08 IC1.3 | v22.34,27.83 v25.2,27.83
  Bottom 0.152: v8.76,9.6 8.76,8.53 R103.1 | R104.2 6.43,8.53 6.43,9.06 v6.97,9.6 7.33,9.96 7.33,12.28 22.34,27.29 v22.34,27.83 | v27.16,29.08 26.45,29.08 v25.2,27.83
N$15  (via drill 0.3)
  Top 0.152: v23.33,31.81 24.12,30.69 29.13,30.69 30.74,29.08 32.52,29.08 IC1.6 | v16.64,39.22 16.62,39.26 16.62,37.66 17.33,36.94 17.33,35.15 20.53,31.96 21.97,31.96 v22.1,31.83
  Bottom 0.152: R119.2 6.43,42.48 8.04,44.09 8.04,44.8 8.22,44.98 9.47,44.98 9.83,44.62 9.83,43.37 8.94,42.48 R118.1 8.76,42.3 8.04,41.59 8.04,39.62 8.22,39.44 9.65,39.44 10.13,39.24 v16.64,39.22
  Bottom 0.203: v23.33,31.81 22.13,31.81 v22.1,31.83
N$16  (via drill 0.3)
  Top 0.152: v33.77,28.18 32.7,28.18 IC1.5 | v31.99,31.04 30.91,31.04 v30.2,31.76 | v26.98,27.65 25.91,27.65 25.38,27.11 v18.71,27.11
  Bottom 0.152: 5.36,40.34 6.25,40.34 R117.2 | 5.36,40.34 4.65,41.05 4.65,43.91 6.08,45.34 9.65,45.34 10.19,44.8 10.19,41.59 8.94,40.34 R116.1 | v33.77,28.18 33.77,29.26 v31.99,31.04 | v30.2,31.76 29.48,31.76 27.88,30.15 27.88,28.54 v26.98,27.65 | v18.71,27.11 12.51,27.11 5.36,34.26 5.36,40.34
N$17  (via drill 0.3)
  Top 0.406: R23.2 29.21,6.4 v29.84,7.04 | v46,9.6 47.24,8.05 47.24,7.47 45.3,5.51 44.44,5.47 44.42,5.49 42.77,5.49 v42.42,5.13
  Bottom 0.406: v29.84,7.04 39.04,7.04 40.97,5.13 v42.42,5.13 | v46,9.6 46.08,9.63 47.9,11.4 47.9,12.29 IC100.2 47.93,13.14 48.13,13.33 48.42,13.33 R110.1
N$18
  Bottom 0.152: R105.2 43.24,7.99 43.24,6.56 45.75,4.06 R100.1
N$19
  Bottom 0.152: R100.2 46.28,2.43 48.61,2.45 49.86,3.7 R101.1 49.86,3.88 49.32,4.42 49.32,7.99 IC100.5
N$20
  Bottom 0.152: 52.18,11.57 52.18,12.99 R109.2 | 54.5,7.28 R102.1 | 48.61,8.17 IC100.6
  Bottom 0.406: 54.5,7.28 54.5,9.24 54.4,9.35 52.93,9.35 52.5,9.78 52.5,11.24 52.18,11.57 51.16,11.57 48.62,9.02 48.62,8.18 48.61,8.17
N$21
  Bottom 0.152: R106.2 54.5,10.67 53.07,12.1 53.07,13.89 52.18,14.78 R109.1 52,14.78 51.11,13.89 51.11,12.35 47.93,9.17 IC100.7
N$22
  Bottom 0.152: R106.1 54.5,12.46 54.5,14.98 55.07,15.54 55.45,15.54 56.24,16.33 56.24,17.15 IC101.1
N$23  (via drill 0.3)
  Top 0.152: R19.2 27.52,8.09 26.67,8.94 U$6.8 | R29.2 26.67,1.92 26.81,1.92 27.23,2.34 27.23,5.26 26.95,5.54 26.95,7.29 27.75,8.09 R19.2 | 27.85,8.09 R19.2 | R19.2 28.16,8.31 v30.48,8.31 | v43.81,4.5 45.72,4.5 47.02,5.79 47.02,6.45 47.92,7.48 R21.1
  Bottom 0.152: v30.48,8.31 31.11,7.67 39.37,7.67 41.27,5.77 43.18,5.77 43.81,5.13 v43.81,4.5
N$24
  Top 0.152: U$7.A 15.9,8.71 15.91,8.72
  pour Top: 21.59,8.94 2.54,8.94 2.54,0.05 13.34,0.05 13.34,8.31 21.59,8.31
N$25
  Top 0.152: R6.2 5.98,27.2 U$4.2
N$26
  Top 0.406: 2.54,38.15 2.54,36.88 6.24,34.45 U$4.6
  Top 2.54: 2.54,38.15 2.54,41.86 0.47UH.1
N$28  (via drill 0.3)
  Top 0.152: 32.09,10.49 R18.2 | 33.69,10.25 v33.66,10.21
  Top 0.406: 32.09,10.49 R20.1 33.69,10.25
  Bottom 0.305: 41.91,8.89 46.61,8.89
  Bottom 0.406: v33.66,10.21 40.64,10.21 41.91,8.89 | 46.61,8.89 48.58,10.92 IC100.3
N$29  (via drill 0.3)
  Top 0.152: v55.88,27.99 56.3,27.57 56.73,27.57 57.15,27.99 59.91,27.99 R5.1 | v53.98,30.53 51.13,30.53 Q2.1
  Bottom 0.152: v55.88,27.99 55.88,28.63 v53.98,30.53
N$30
  Top 0.152: R4.2 4.41,27.74 5.08,27.74 5.48,28.14 U$4.1
N$31  (via drill 0.3, 0.5)
  Top 0.152: Q1.1 50.57,33.55 52.07,32.05 54.86,32.05 55.24,32.44 55.24,33.58 55.52,33.92 56.52,33.92 v56.57,33.88 | v57.78,30.53 R3.1
  Bottom 0.152: v57.78,30.53 57.17,31.14 57.17,33.53 56.82,33.88 v56.57,33.88
N$32
  Top 0.406: R_SENSE1.V1 21.95,35.59 U$3.4
N$33
  Top 0.406: R_SENSE1.V2 22.11,38.34 20.95,37.19 U$3.5
N$34
  Top 0.152: 32.13,37.59 RSENSE1.V1
  Top 0.406: U$2.4 37.71,37.42 37.16,37.97 35.61,37.97 35.23,37.59 32.13,37.59
N$35
  Top 0.406: RSENSE1.V2 29.31,37.87 30.4,36.78 35.51,36.78 35.53,36.8 35.66,36.8 35.89,37.03 36.83,37.03 37.06,36.8 U$2.5
N$37  (via drill 0.3)
  Top 0.152: R10.1 51.42,21.64 v53.98,21.64
  Bottom 0.152: v53.98,21.64 53.98,22.91 52.07,24.82 52.07,37.52 50.8,38.79 50.8,41.02 Q100.1
N$38
  Top 0.152: 25.9,6.23 R23.1
  Top 0.406: RSENSE2.I2 25.9,6.23
N$40
  Top 0.152: 31.98,8.83 R18.1
  Top 0.406: 29.59,4.62 31.98,7.01 31.98,8.83
  Top 0.61: RSENSE2.I1 29.59,4.62
N$45  (via drill 0.3)
  Top 0.152: U$1.1 52.9,33.92 v52.9,32.65
  Bottom 0.152: v52.9,32.65 52.9,26.04 54.86,24.07 54.86,19.12 IC101.4 54.55,19.43 DSP_CMD.1
N$48
  Top 0.152: C5.1 22.52,22.82 23.95,22.82 24.12,22.64 Q3.2 24.3,22.47 25.15,22.45 25.5,22.45 26.82,21.13 27.85,21.13 U$5.5
N$50
  Top 0.152: C6.1 22.52,20.5 23.95,20.5 24.12,20.68 Q3.1 24.3,20.68 26.62,20.68 26.95,20.35 27.82,20.35 U$5.6
RST/SBWTDIO  (via drill 0.3)
  Top 0.152: v15.24,14.66 15.24,16.56 JP2.1 11.98,20.82 R11.2 | v24.13,15.29 24.13,19.1 24.79,19.76 27.88,19.76 U$5.7
  Bottom 0.152: v24.13,15.29 20.32,11.48 18.41,11.48 v15.24,14.66
SC+
  Top 1.27: JP1.6 JP1.5 26.7,41.94 27.74,41.05 31.32,41.07 31.85,40.39 RSENSE1.I1
TB0  (via drill 0.3)
  Top 0.152: U$5.17 29.61,13.28 v33.3,16.97 | v37.03,18.82 51.05,18.82 52.43,17.45 54.15,17.45 56.67,19.96 59.59,19.96 60.25,20.62 60.25,21.97 60.86,22.58 SLEEP.2
  Bottom 0.152: v33.3,16.97 35.15,18.82 v37.03,18.82 | R111.1 62.23,22.59 SLEEP.2
TB1  (via drill 0.3)
  Top 0.152: U$5.18 29.8,12.63 32.64,15.47 v33.17,15.47 | v37.06,17.75 37.74,18.36 50.75,18.36 52.2,16.92 54.36,16.92 56.44,19 60.27,19 61.32,20.04 SLEEP.1
  Bottom 0.152: v33.17,15.47 35.46,17.75 v37.06,17.75 | SLEEP.1 61.91,20.05 61.91,20.69 60.9,20.69 60.17,21.41 60.17,24.88 R112.1
TEST/SBWTCK
  Top 0.152: JP2.2 12.15,23.41 12.51,24.07 26.14,24.07 26.54,23.68 U$5.1
V_BT_MS
  Top 0.152: C7.2 42.17,16.39 41.99,16.21 39.49,16.21 R13.1 39.31,16.21 38.55,16.21 37.67,17.09 35.69,17.09 U$5.28
V_BUS_MS
  Top 0.152: 39.49,12.46 41.99,12.46 42.17,12.64 C12.2 | 39.49,12.46 R17.1 | 39.49,12.46 38.92,12.46 36.83,14.55 36.83,16.23 36.47,16.59 35.66,16.59 U$5.27
VCC  (via drill 0.3)
  Top 0.152: 24.84,33.9 22.7,33.9 | 22.7,33.9 21.62,33.9 U$3.3 | 24.84,33.9 27.7,31.04 v29.66,31.04 30.38,31.04 31.09,30.33 32.52,30.33 IC1.8 32.7,30.15 33.75,30.15 35.35,28.69 v35.56,28.72 | 22.7,33.9 v22.7,30.89 | 31.45,26.22 C_IC1.2 | 10.01,9.6 v10.01,7.99 | 25.99,15.26 26.17,14.96 | 25.99,15.26 26.04,15.29 C10.2 26.12,14.78 26.39,14.78 27.23,13.94 27.89,13.94 U$5.16 | VCC.1 41.91,26.72 43.18,25.45 | 58.42,34.98 U$1.2 | U$4.3 6.49,26.17 R6.1 7.31,25.34 9.7,25.34 | R11.1 9.14,23.8 8.89,24.05 | 24.84,33.9 25.35,34.41 R_SENSE1.I1 | U$2.3 37.71,32.6 38.43,31.88 | 55.24,9.26 C_IC2.2 | 25.99,15.26 25.92,15.34 | 61.92,35.33 62.08,35.18 v62.08,28.37 | v60.27,28.83 60.27,33.86 61.39,34.98
  Top 0.254: U$6.3 20.2,8.94 C13.2 | U$4.3 U$4.4
  Top 0.406: v56.13,5.64 56.39,5.89 56.39,8.01 C_IC2.2 54.48,9.17 53.72,8.41 v51.08,8.41 | 54.23,15.93 53.66,15.93 53.25,16.33 51.71,16.33 50.39,17.65 v48.26,17.65 | 54.23,15.93 54.33,15.93 56.52,18.11 59.18,18.11 v59.31,18.11 | 55.24,9.26 55.24,9.63 v55.78,10.16 | v55.85,11.56 55.85,14.3 54.23,15.93 | IC2.8 51.09,10.3 v50.55,9.75 50.01,10.29 45.47,10.29 45.29,10.11 v45.29,10.08 45.29,8.74 v46.35,7.67 | v41.66,10.46 40.64,9.45 40.64,8.94 40.64,5.79 41,5.44 41,2.51 42.82,0.69 42.98,0.53 48.67,0.53 50.59,2.45 R26.1 | C13.2 19.05,11.88 v19.05,13.07 22.34,13.07 v22.63,12.78 | 25.92,15.34 v25.92,17.1 | 31.45,26.22 34.5,26.22 35.56,27.28 v35.56,28.63 | v23.9,12.8 23.9,12.99 C10.2 | U$5.2 28.79,23.03 29.16,22.66 29.16,20.42 v29.21,20.37
  Top 0.61: 45.85,22.71 47.57,22.71 v47.62,21.69 | v35.56,28.63 35.51,28.63 35.51,31.88
  Top 1.27: 5.18,12.65 1.27,16.56 1.27,24.05 8.89,24.05 9.7,25.34 10.16,26.09 15.24,26.09 16.48,27.13 16.46,34.42 13.34,34.98 | U$1.2 58.17,33.85 58.17,33.2 53.98,27.99 54.1,28.17 51.13,22.71 45.85,22.71 43.2,25.3 | 15.88,48.31 60.22,48.36 60.73,48.36 62.48,46.61 62.48,35.89 61.92,35.33 61.57,34.98 61.39,34.98 58.42,34.98 | 43.18,25.45 43.2,25.3 | 43.2,25.3 43.2,26.42 | 43.2,26.42 43.18,31.39 42.7,31.88 38.43,31.88 35.51,31.88 35.15,31.88 34.31,31.88 29.92,35.53 28.37,35.53 26.8,37.11 | RSENSE1.I2 27.3,39.32 27,39.01 27,37.24 R_SENSE1.I1 | 43.2,25.3 43.2,26.42
  Top 1.676: 10UH.1 5.18,12.65
  Bottom 0.152: v22.7,30.89 22.7,29.97 R115.1 | v29.66,31.04 29.66,29.97 R114.1 | R113.1 35.92,29.79 35.92,29.08 v35.56,28.72 v35.56,28.63 | v10.01,7.99 8.94,6.92 R103.2 | 24.3,17.1 FERRITE.2 | 43.78,13.17 C_IC100.2 | 43.24,12.46 43.78,12.99 C_IC100.2 | 43.24,9.96 R105.1 | 24.12,17.1 FERRITE.2 | v46.35,7.67 46.86,7.67 IC100.8 | C_IC100.2 43.78,13.17 | 19.47,19.85 C103.+ | FERRITE.2 FERRITE.1 | 26.04,17.2 v25.92,17.1 | R112.2 60.2,28.75 v60.27,28.83 | C_IC101.2 56.3,18.99 IC101.6 | R111.2 62.23,28.22 v62.08,28.37
  Bottom 0.406: v56.13,5.64 57.99,3.78 C100.2 60.02,4.46 U$100.3 | v47.62,21.69 47.62,18.29 v48.26,17.65 | v59.31,18.11 58.46,18.96 58.46,19.01 57.76,19.01 C_IC101.2 | v55.78,10.16 55.78,11.48 v55.85,11.56 | v50.55,9.75 50.55,8.94 v51.08,8.41 | v45.29,10.08 45.16,9.96 43.24,9.96 43.24,12.6 C_IC100.2 | R105.1 42.38,9.74 v41.66,10.46 | v29.21,20.37 29.18,20.37 v25.92,17.1 24.3,17.1 | v22.63,12.78 23.88,12.78 v23.9,12.8 | v19.05,13.07 19.05,17.41 C102.1 19.47,19.85
  pour Top: 8.89,48.95 8.89,32.44 12.06,32.44 12.06,34.34 16.51,34.34 16.51,48.95
  pour Top: 20.95,8.94 20.32,8.31 20.32,9.58 2.54,9.58 2.54,15.14 11.43,15.14 11.43,12.12 19.68,12.12
VREF  (via drill 0.3)
  Top 0.152: 35.56,8.65 R20.2 | IC2.5 53.47,10.85 v56.52,10.85 VREF.1
  Top 0.406: 35.56,8.65 v35.56,6.15 | R28.2 46.01,1.32 v44.45,1.32
  Bottom 0.152: 54.68,5.67 R102.2
  Bottom 0.406: 56.62,7.59 56.67,7.63 56.67,10.69 arc90 v56.52,10.85 | 56.62,7.59 54.68,5.67 | R102.2 54.61,1.32 53.72,0.43 43.56,0.43 | v44.45,1.32 43.56,0.43 | v35.56,6.15 35.56,3.86 35.94,3.48 40.08,3.48 43.13,0.43 43.56,0.43 | C101.2 59.98,11.5 U$100.6 60.02,10.16 59.16,9.3 58.34,9.3 56.62,7.59

### Text on the board
tNames: BT+ | GD | SC+ | GD | EX1 | EX2 | EX3 | GD | HEAT_BUS | DISSIP | HT1 | HT2 | HT3 | GD | TEST | TB0 TB1 | SCL | RST | SDA | AN1 | AN2 | AN3 | AN4 | GND1 | GND2 | GND3 | GND4
bNames: Octanis_EPS v0.4